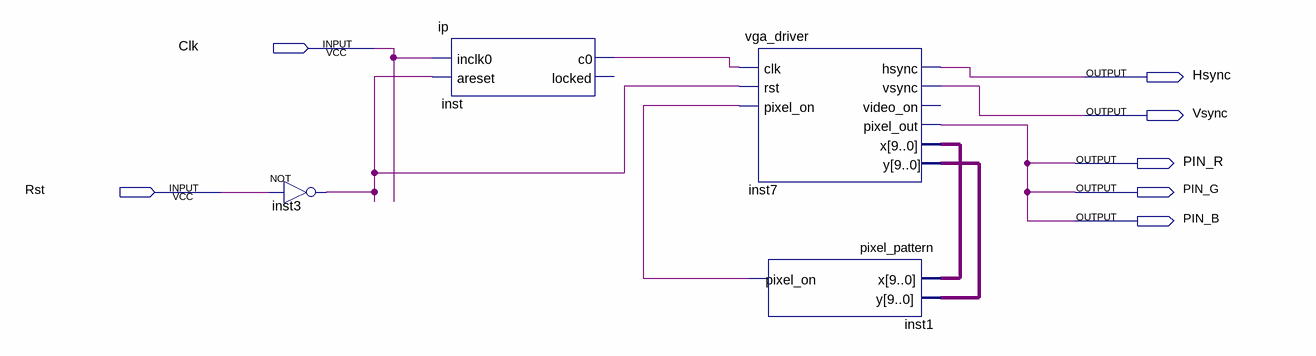
[diagram p0: schematic sheet]
// Quartus schematic Block2.bdf as structural Verilog: 4 symbols, 7 pins
module Block2 (
  input  Clk,
  input  Rst,
  output Hsync,
  output Vsync,
  output PIN_R,
  output PIN_G,
  output PIN_B
);

  wire inst1_pixel_on, inst3_out, inst_c0;
  wire [9:0] inst7_x, inst7_y;

  not inst3 (inst3_out, Rst);
  ip inst (.areset(inst3_out), .inclk0(Clk), .c0(inst_c0));  // open: locked
  vga_driver inst7 (
    .clk(inst_c0), .rst(inst3_out), .pixel_on(inst1_pixel_on), .hsync(Hsync), .vsync(Vsync),
    .pixel_out(PIN_B), .x(inst7_x), .y(inst7_y));  // open: video_on
  pixel_pattern inst1 (.x(inst7_x), .y(inst7_y), .pixel_on(inst1_pixel_on));

  assign PIN_G = PIN_B;
  assign PIN_R = PIN_B;
endmodule
